# Altium schematic sheet RS485_Transceiver.SchDoc
size Letter
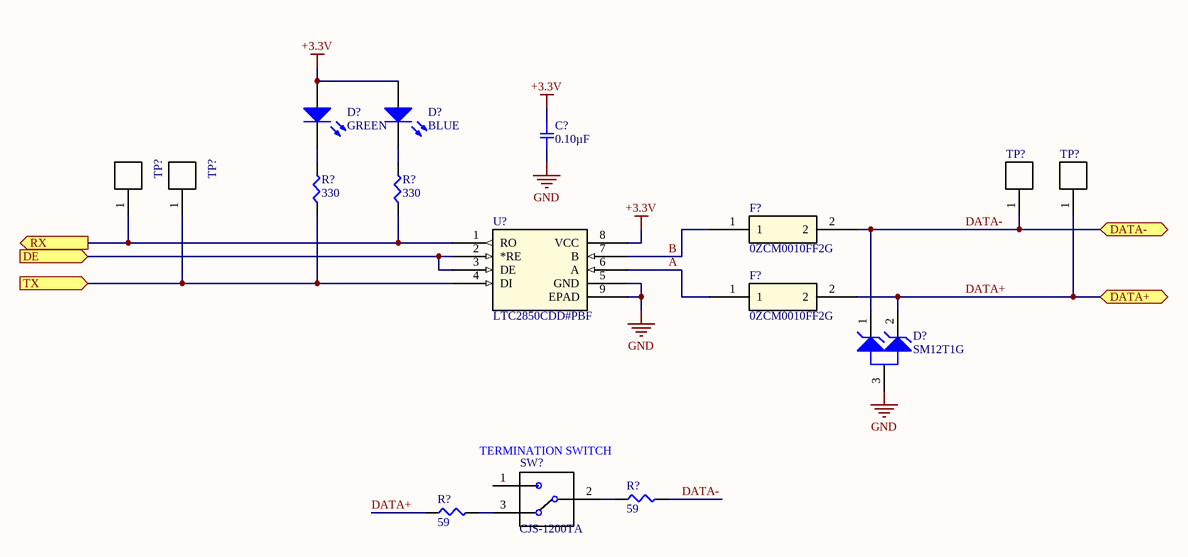
[diagram p0: RS485_Transceiver.SchDoc]

## Parts
(Parts that share a designator on the sheet are numbered #1, #2 ... from top to bottom, then left to right.)
C?  0.10µF  [SMD-0603C]
D?#1  GREEN  [LED_603]
D?#2  BLUE  [LED_603]
D?#3  SM12T1G  [ONSC-SOT-23-3-318-08_V]
F?#1  0ZCM0010FF2G  [0ZCM]
F?#2  0ZCM0010FF2G  [0ZCM]
R?#1  330  [SMD-0603-RES]
R?#2  330  [SMD-0603-RES]
R?#3  59  [SMD-0603-RES]
R?#4  59  [SMD-0603-RES]
SW?  CJS-1200TA  [CJS-1200TA]
TP?#1  RX  [TE_RCU-0C]  (value not drawn)
TP?#2  TX  [TE_RCU-0C]  (value not drawn)
TP?#3  D-  [TE_RCU-0C]  (value not drawn)
TP?#4  D+  [TE_RCU-0C]  (value not drawn)
U?  LTC2850CDD#PBF  [DFN-8_DD]

## Ports
DATA+ (bidir), DATA- (bidir), DE (in), RX (out), TX (in)

## Nets
+3.3V: C?.1 D?#1.1(A) D?#2.1(A) U?.8(VCC)
GND: C?.2 D?#3.3(A) U?.5(GND) U?.9(EPAD)
A: F?#2.1 U?.6(A)
B: F?#1.1 U?.7(B)
DATA+: D?#3.2(K2) F?#2.2 R?#4.1 TP?#4.1 ; port DATA+
DATA-: D?#3.1(K1) F?#1.2 R?#3.2 TP?#3.1 ; port DATA-
DE: U?.2(*RE) U?.3(DE) ; port DE
RX: R?#2.1 TP?#1.1 U?.1(RO) ; port RX
TX: R?#1.1 TP?#2.1 U?.4(DI) ; port TX
NetD?#1_2: D?#1.2(K) R?#1.2
NetD?#2_2: D?#2.2(K) R?#2.2
NetR?#3_1: R?#3.1 SW?.2
NetR?#4_2: R?#4.2 SW?.3

Not connected (* = marked no-connect by the designer): SW? 1

## Notes on the sheet
- (near SW?) TERMINATION SWITCH

## Library data of the parts
C? = GCJ188R71C104KA01D: CAP CER 0.1UF 16V X7R 0603; Manufacturer: Murata Electronics North America; Factory Stock: 0; Unit Price (USD): 0.21; Minimum Quantity: 1; Tolerance: ±10%; Datasheets: http://www.murata.com/~/media/webrenewal/support/library/catalog/products/capacitor/mlcc/c03e.ashx; Image: //media.digikey.com/Renders/Murata%20Renders/0603%28LQG18%29.jpg; Digi-Key Part Number: 490-5796-1-ND; Part Number: GCJ188R71C104KA01D; Quantity Available: 22473; @ qty: 0; Packaging: Cut Tape (CT); Series: GCJ; Part Status: Active; Value: 0.10µF; Voltage: 16V; Temperature Coefficient: X7R; Operating Temperature: -55°C ~ 125°C; Features: Soft Termination; Ratings: AEC-Q200; Applications: Automotive, Boardflex Sensitive; Mounting Type: Surface Mount, MLCC; Package / Case: 0603 (1608 Metric); Size / Dimension: 0.063" L x 0.031" W (1.60mm x 0.80mm); Height - Seated (Max): -; Thickness (Max): 0.035" (0.90mm); Lead Spacing: -; Lead Style: -
D?#1 D?#2 = LED_603
D?#3 = SM12T1G: Transient Voltage Suppressor Diode Array, Dual Common Anode Diodes for ESD Protection, 3-Pin SOT-23, Pb-Free, Tape and Reel; Manufacturer: On Semiconductor; Direction: Unidirectional; IR Max (uA): 1; PPK Max (W): 300; DatasheetVersion: Rev. 6; PackageVersion: Rev. AP, 11/2009; PackageReference: SOT-23-3-318-08; PackageDescription: 3-Pin Small Outline Transistor, Body 2.92 x 1.3 mm, Pitch 0.95 mm; Supplier 1: Digi-Key; Supplier Part Number 1: SM12T1GOSTR-ND; Supplier 2: Digi-Key; Supplier Part Number 2: SM12T1GOSCT-ND; Supplier 3: Digi-Key; Supplier Part Number 3: SM12T1GOSDKR-ND; Supplier 4: Farnell; Supplier Part Number 4: 1878535; Supplier 5: Newark; Supplier Part Number 5: 42K2650; Supplier 6: Newark; Supplier Part Number 6: 10N9612; Supplier 7: Mouser; Supplier Part Number 7: 863-SM12T1G; Packing: Tape and Reel; RoHS: Pb-Free; Mounting Technology: Surface Mount; PartNumber: SM12T1G; ComponentLink1Description: Manufacturer URL; ComponentLink1URL: http://www.onsemi.com/; ComponentLink2Description: Datasheet; ComponentLink2URL: http://www.onsemi.com/pub_link/Collateral/SM12T1-D.PDF; ComponentLink3Description: Package Specification; ComponentLink3URL: http://www.onsemi.cn/pub_link/Collateral/318-08.PDF
F?#1 F?#2 = 0ZCM0010FF2G: Imported; Vendor: Belfuse; Built_By: EMA_UL_Team; Type: DEV; C: Copyright (C) 2016 Accelerated Designs. All rights reserved; Manufacturer_Part_Number: 0ZCM0010FF2G; RefDes: RefDes; Value: Value
R?#1 R?#2 = ERJ-3EKF3300V: RES SMD 330 OHM 1% 1/10W 0603; Manufacturer: Panasonic Electronic Components; Factory Stock: 0; Unit Price (USD): 0.00379; @ qty: 1500; Minimum Quantity: 1; Power (Watts): 0.1W, 1/10W; Temperature Coefficient: ±100ppm/°C; Part Number: ERJ-3EKF3300V; Datasheets: http://industrial.panasonic.com/www-cgi/jvcr13pz.cgi?E+PZ+3+AOA0002+ERJ3EKF3300V+7+WW; Image: //media.digikey.com/Photos/Panasonic%20Photos/MFG_ERJ-P6W%20Series.jpg; Digi-Key Part Number: P330HCT-ND; Quantity Available: 670984; Packaging: Cut Tape (CT); Series: ERJ; Part Status: Active; Value: 330; Tolerance: ±1%; Composition: Thick Film; Features: Automotive AEC-Q200; Operating Temperature: -55°C ~ 155°C; Package / Case: 0603 (1608 Metric); Supplier Device Package: 0603; Size / Dimension: 0.063" L x 0.031" W (1.60mm x 0.80mm); Height - Seated (Max): 0.022" (0.55mm); Number of Terminations: 2; Failure Rate: -
R?#3 R?#4 = ERJ-3EKF59R0V: RES SMD 59 OHM 1% 1/10W 0603; Manufacturer: Panasonic Electronic Components; Factory Stock: 0; Unit Price (USD): 0.00379; @ qty: 1500; Minimum Quantity: 1; Power (Watts): 0.1W, 1/10W; Temperature Coefficient: ±100ppm/°C; Part Number: ERJ-3EKF59R0V; Datasheets: http://industrial.panasonic.com/www-cgi/jvcr13pz.cgi?E+PZ+3+AOA0002+ERJ3EKF59R0V+7+WW; Image: //media.digikey.com/Photos/Panasonic%20Photos/MFG_ERJ-P6W%20Series.jpg; Digi-Key Part Number: P59.0HCT-ND; Quantity Available: 101178; Packaging: Cut Tape (CT); Series: ERJ; Part Status: Active; Value: 59; Tolerance: ±1%; Composition: Thick Film; Features: Automotive AEC-Q200; Operating Temperature: -55°C ~ 155°C; Package / Case: 0603 (1608 Metric); Supplier Device Package: 0603; Size / Dimension: 0.063" L x 0.031" W (1.60mm x 0.80mm); Height - Seated (Max): 0.022" (0.55mm); Number of Terminations: 2; Failure Rate: -
SW? = CJS-1200TA: SWITCH SLIDE SPDT 100MA 6V / Manufacturer PN: CJS-1200TA; MF: Nidec Copal; Package: None; Digi-Key_Purchase_URL: https://www.digikey.com/product-detail/en/nidec-copal-electronics/CJS-1200TA/563-1021-1-ND/948401?utm_source=snapeda&utm_medium=aggregator&utm_campaign=symbol; Digi-Key_Part_Number: 563-1021-1-ND; SnapEDA_Link: https://www.snapeda.com/parts/CJS-1200TA/Nidec%20Copal%20Electronics/view-part/?ref=snap; MP: CJS-1200TA; Value: *
TP?#1-TP?#4 = RCU-0C: 0603 PROBE PAD; Power_Rating: 0 W; Resistance: <.05; MF: TE Connectivity; Tolerance: 0%; Digi-Key_Part_Number: A106145CT-ND; EU_RoHS_Compliance: Compliant; Digi-Key_Purchase_URL: https://www.digikey.com/product-detail/en/te-connectivity-amp-connectors/RCU-0C/A106145CT-ND/3477802?utm_source=snapeda&utm_medium=aggregator&utm_campaign=symbol; SnapEDA_Link: https://www.snapeda.com/parts/RCU-0C/TE%20Connectivity%20AMP%20Connectors/view-part/?ref=snap; Link: http://www.te.com/usa-en/product-1625854-3.html; MP: RCU-0C; Package: 0603; Value: *
U? = LTC2850CDD#PBF: Imported; Vendor: Linear Technology; Built_By: EMA_UL_Team; Manufacturer_Part_Number: LTC2850CDD#PBF; RefDes: RefDes; Type: DEV; Value: Value